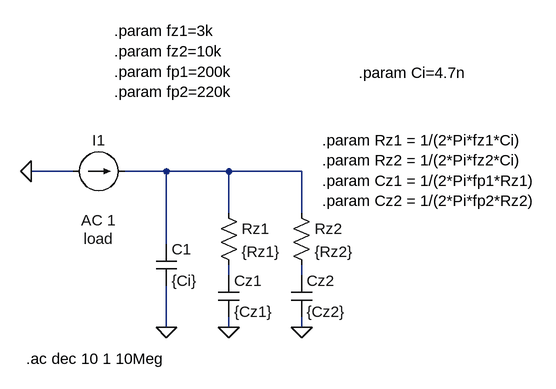
[diagram p0: schematic Draft1.asc]
Draft1.asc, the LTspice schematic file:
Version 4.1
SHEET 1 880 680
WIRE -144 80 -208 80
WIRE 0 80 -64 80
WIRE 96 80 0 80
WIRE 208 80 96 80
WIRE 96 144 96 80
WIRE 208 144 208 80
WIRE 0 192 0 80
WIRE 96 240 96 224
WIRE 208 240 208 224
WIRE 0 320 0 256
WIRE 96 320 96 304
WIRE 208 320 208 304
FLAG 0 320 0
FLAG 96 320 0
FLAG 208 320 0
FLAG -208 80 0
SYMBOL res 80 128 R0
SYMATTR InstName Rz1
SYMATTR Value {Rz1}
SYMBOL cap 80 240 R0
SYMATTR InstName Cz1
SYMATTR Value {Cz1}
SYMBOL cap -16 192 R0
SYMATTR InstName C1
SYMATTR Value {Ci}
SYMBOL res 192 128 R0
SYMATTR InstName Rz2
SYMATTR Value {Rz2}
SYMBOL cap 192 240 R0
SYMATTR InstName Cz2
SYMATTR Value {Cz2}
SYMBOL current -144 80 R270
WINDOW 0 32 40 VTop 2
WINDOW 3 -32 40 VBottom 2
WINDOW 123 -60 40 VBottom 2
WINDOW 39 -88 40 VBottom 2
SYMATTR InstName I1
SYMATTR Value ""
SYMATTR Value2 AC 1
SYMATTR SpiceLine load
TEXT -216 368 Left 2 !.ac dec 10 1 10Meg
TEXT 240 32 Left 2 !.param Rz1 = 1/(2*Pi*fz1*Ci)\n.param Rz2 = 1/(2*Pi*fz2*Ci)\n.param Cz1 = 1/(2*Pi*fp1*Rz1)\n.param Cz2 = 1/(2*Pi*fp2*Rz2)
TEXT -80 -136 Left 2 !.param fz1=3k\n.param fz2=10k\n.param fp1=200k\n.param fp2=220k
TEXT 296 -72 Left 2 !.param Ci=4.7n

The netlist it stands for:
* Draft1.asc
Rz1 N001 N002 {Rz1}
Cz1 N002 0 {Cz1}
C1 N001 0 {Ci}
Rz2 N001 N003 {Rz2}
Cz2 N003 0 {Cz2}
I1 0 N001 AC 1 load
.ac dec 10 1 10Meg
.param Rz1 = 1/(2*Pi*fz1*Ci)
.param Rz2 = 1/(2*Pi*fz2*Ci)
.param Cz1 = 1/(2*Pi*fp1*Rz1)
.param Cz2 = 1/(2*Pi*fp2*Rz2)
.param fz1=3k
.param fz2=10k
.param fp1=200k
.param fp2=220k
.param Ci=4.7n
.backanno
.end